# Altium schematic sheet 2.4寸带固定框x3.SchDoc
size A4
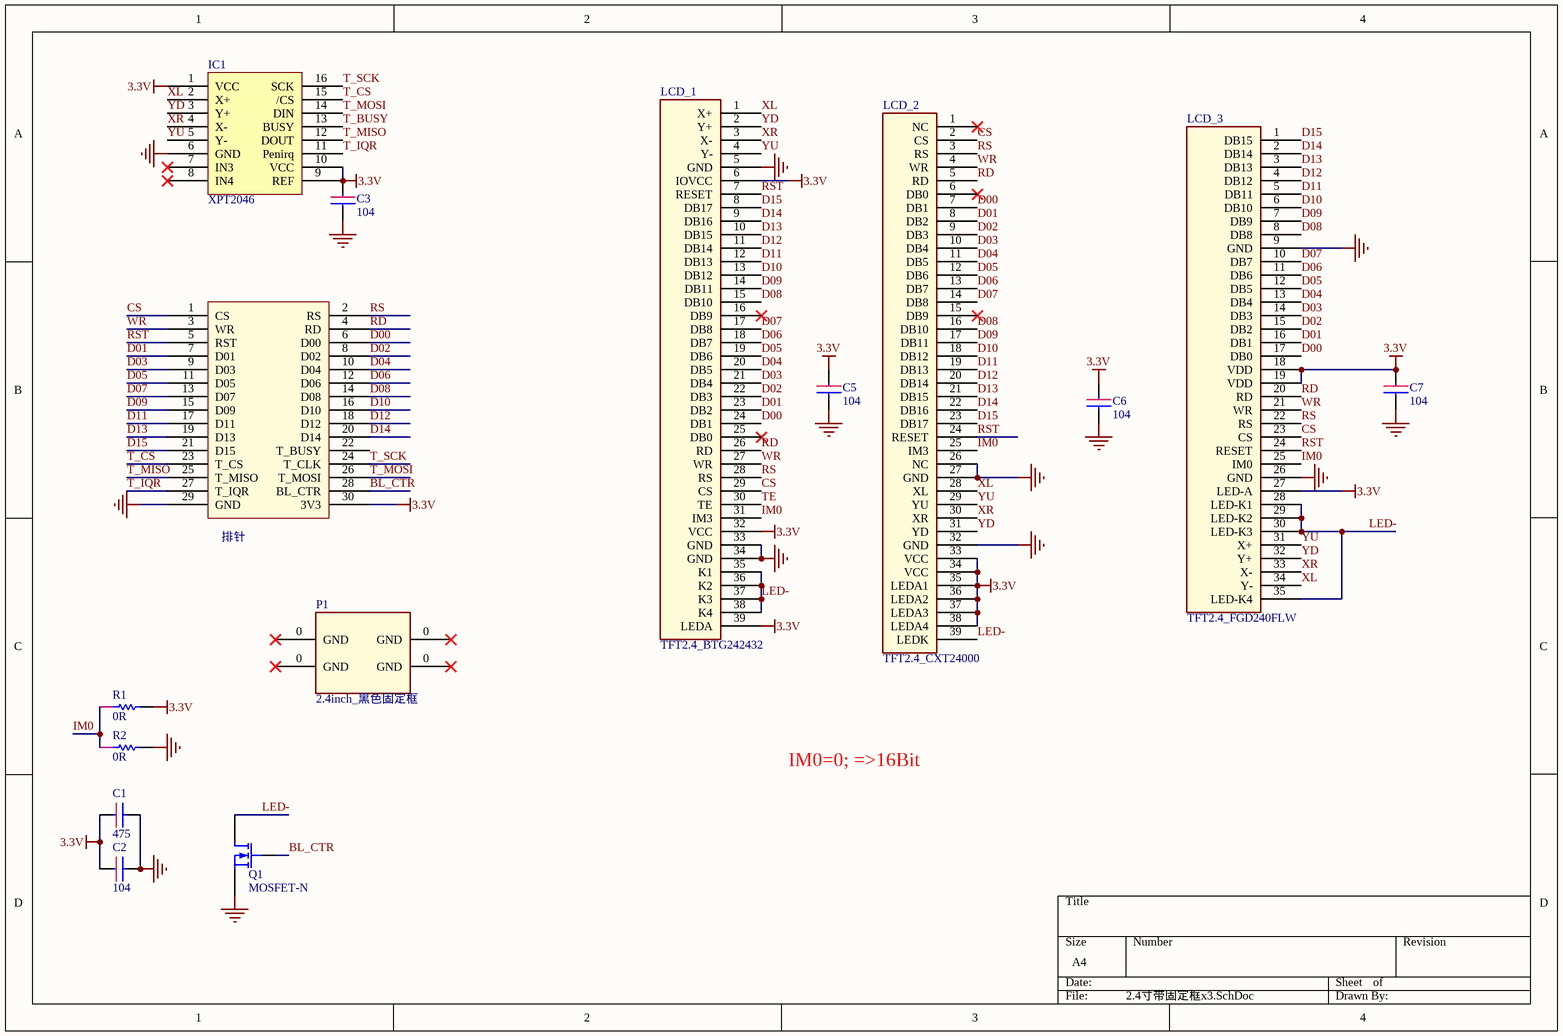
[diagram p0: 2.4寸带固定框x3.SchDoc]

## Parts
C1  475  [C0603-2]
C2  104  [C0603-1]
C3  104  [C0603-2]
C5  104  [C0603-1]
C6  104  [C0603-1]
C7  104  [C0603-1]
IC1  XPT2046  [SOT403-1]
LCD_1  TFT2.4_BTG242432  [TFT2.4_BTG242432]
LCD_2  TFT2.4_CXT24000  [TFT2.4_CXT24000]
LCD_3  TFT2.4_FGD240FLW  [TFT2.4_FGD240FLW]
P1  2.4inch_黑色固定框  [2.4inch_黑色固定框]
Q1  MOSFET-N  [SOT23A]
R1  0R  [R0603]
R2  0R  [R0603]
公认通用  排针  [P_Head_2x15]

## Nets
3.3V: C1.1 C2.1 C3.1 C5.1 C6.1 C7.1 IC1.1(VCC) IC1.9(REF) IC1.10(VCC) LCD_1.6(IOVCC) LCD_1.32(VCC) LCD_1.39(LEDA) LCD_2.33(VCC) LCD_2.34(VCC) LCD_2.35(LEDA1) LCD_2.36(LEDA2) LCD_2.37(LEDA3) LCD_2.38(LEDA4) LCD_3.18(VDD) LCD_3.19(VDD) LCD_3.27(LED-A) R1.2 公认通用.30(3V3)
GND: C1.2 C2.2 C3.2 C5.2 C6.2 C7.2 IC1.6(GND) LCD_1.5(GND) LCD_1.33(GND) LCD_1.34(GND) LCD_2.26(NC) LCD_2.27(GND) LCD_2.32(GND) LCD_3.9(GND) LCD_3.26(GND) Q1.2(S) R2.2 公认通用.29(GND)
BL_CTR: Q1.1(G) 公认通用.28(BL_CTR)
CS: LCD_1.29(CS) LCD_2.2(CS) LCD_3.23(CS) 公认通用.1(CS)
D00: LCD_1.24(DB1) LCD_2.7(DB1) LCD_3.17(DB0) 公认通用.6(D00)
D01: LCD_1.23(DB2) LCD_2.8(DB2) LCD_3.16(DB1) 公认通用.7(D01)
D02: LCD_1.22(DB3) LCD_2.9(DB3) LCD_3.15(DB2) 公认通用.8(D02)
D03: LCD_1.21(DB4) LCD_2.10(DB4) LCD_3.14(DB3) 公认通用.9(D03)
D04: LCD_1.20(DB5) LCD_2.11(DB5) LCD_3.13(DB4) 公认通用.10(D04)
D05: LCD_1.19(DB6) LCD_2.12(DB6) LCD_3.12(DB5) 公认通用.11(D05)
D06: LCD_1.18(DB7) LCD_2.13(DB7) LCD_3.11(DB6) 公认通用.12(D06)
D07: LCD_1.17(DB8) LCD_2.14(DB8) LCD_3.10(DB7) 公认通用.13(D07)
D08: LCD_1.15(DB10) LCD_2.16(DB10) LCD_3.8(DB8) 公认通用.14(D08)
D09: LCD_1.14(DB11) LCD_2.17(DB11) LCD_3.7(DB9) 公认通用.15(D09)
D10: LCD_1.13(DB12) LCD_2.18(DB12) LCD_3.6(DB10) 公认通用.16(D10)
D11: LCD_1.12(DB13) LCD_2.19(DB13) LCD_3.5(DB11) 公认通用.17(D11)
D12: LCD_1.11(DB14) LCD_2.20(DB14) LCD_3.4(DB12) 公认通用.18(D12)
D13: LCD_1.10(DB15) LCD_2.21(DB15) LCD_3.3(DB13) 公认通用.19(D13)
D14: LCD_1.9(DB16) LCD_2.22(DB16) LCD_3.2(DB14) 公认通用.20(D14)
D15: LCD_1.8(DB17) LCD_2.23(DB17) LCD_3.1(DB15) 公认通用.21(D15)
IM0: LCD_1.31(IM3) LCD_2.25(IM3) LCD_3.25(IM0) R1.1 R2.1
LED-: LCD_1.35(K1) LCD_1.36(K2) LCD_1.37(K3) LCD_1.38(K4) LCD_2.39(LEDK) LCD_3.28(LED-K1) LCD_3.29(LED-K2) LCD_3.30(LED-K3) LCD_3.35(LED-K4) Q1.3(D)
RD: LCD_1.26(RD) LCD_2.5(RD) LCD_3.20(RD) 公认通用.4(RD)
RS: LCD_1.28(RS) LCD_2.3(RS) LCD_3.22(RS) 公认通用.2(RS)
RST: LCD_1.7(RESET) LCD_2.24(RESET) LCD_3.24(RESET) 公认通用.5(RST)
T_BUSY: IC1.13(BUSY)
T_CS: IC1.15(/CS) 公认通用.23(T_CS)
T_IQR: IC1.11(Penirq) 公认通用.27(T_IQR)
T_MISO: IC1.12(DOUT) 公认通用.25(T_MISO)
T_MOSI: IC1.14(DIN) 公认通用.26(T_MOSI)
T_SCK: IC1.16(SCK) 公认通用.24(T_CLK)
TE: LCD_1.30(TE)
WR: LCD_1.27(WR) LCD_2.4(WR) LCD_3.21(WR) 公认通用.3(WR)
XL: IC1.2(X+) LCD_1.1(X+) LCD_2.28(XL) LCD_3.34(Y-)
XR: IC1.4(X-) LCD_1.3(X-) LCD_2.30(XR) LCD_3.33(X-)
YD: IC1.3(Y+) LCD_1.2(Y+) LCD_2.31(YD) LCD_3.32(Y+)
YU: IC1.5(Y-) LCD_1.4(Y-) LCD_2.29(YU) LCD_3.31(X+)

Not connected (* = marked no-connect by the designer): IC1 7(IN3)* 8(IN4)*; LCD_1 16(DB9)* 25(DB0)*; LCD_2 1(NC)* 6(DB0)* 15(DB9)*; P1 0(GND)*; 公认通用 22(T_BUSY)

## Notes on the sheet
- IM0=0; =>16Bit  DB[15:0]
  IM0=1; => 8Bit   DB[15:8]

## Library data of the parts
C1-C3 C5-C7 = cap
IC1 = ADS7843
R1 R2 = Resistor
公认通用 = LCD_common